# EAGLE schematic Stepper_Driver (EAGLE 9.3.0)
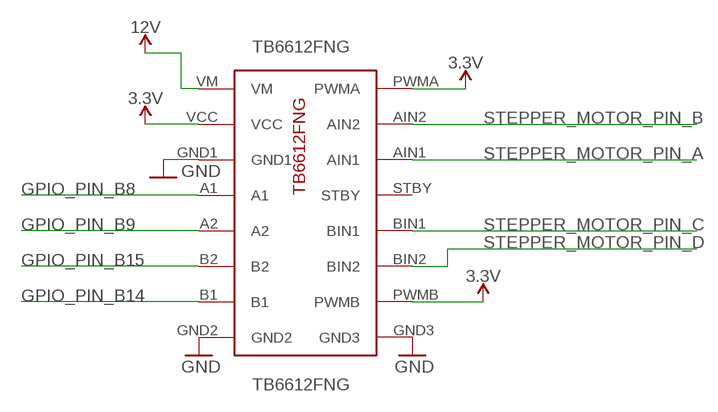
[diagram p0: schematic, sheet 1]

## Parts
TB6612FNG  TB6612FNG  [TB6612FNG]

## Nets
GND: TB6612FNG.GND1 TB6612FNG.GND2 TB6612FNG.GND3
GPIO_PIN_B8: TB6612FNG.A1
GPIO_PIN_B9: TB6612FNG.A2
GPIO_PIN_B14: TB6612FNG.B1
GPIO_PIN_B15: TB6612FNG.B2
STEPPER_MOTOR_PIN_A: TB6612FNG.AIN1
STEPPER_MOTOR_PIN_B: TB6612FNG.AIN2
STEPPER_MOTOR_PIN_C: TB6612FNG.BIN1
STEPPER_MOTOR_PIN_D: TB6612FNG.BIN2
VCC: TB6612FNG.PWMA TB6612FNG.PWMB TB6612FNG.VCC TB6612FNG.VM ; supply symbol labelled 3.3V, 12V
Unconnected: TB6612FNG.STBY

## Library data of the parts
TB6612FNG = TB6612FNG:TB6612FNG